# EAGLE design main (EAGLE 9.4.0)
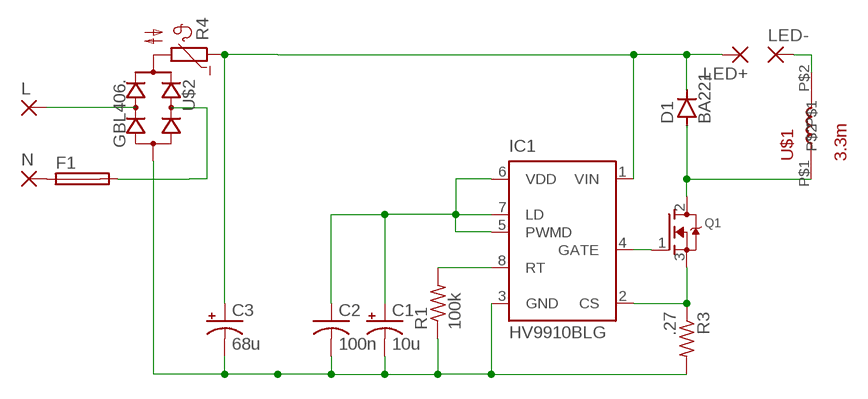
[diagram p0: schematic, sheet 1]

## Parts
C1  10u  CPOL-USCT7343  [CT7343]
C2  100n  C-USC0603  [C0603]
C3  68u  CPOL-USE7.5-16  [E7,5-16]
D1  BA221  [DO35-10]
F1  SH22,5A  [SH22,5A]
IC1  HV9910BLG  [SOIC-08LG]
L  2,54/1,0  [2,54/1,0]
LED+  2,54/1,0  [2,54/1,0]
LED-  2,54/1,0  [2,54/1,0]
N  2,54/1,0  [2,54/1,0]
Q1  MOSFET-NGDS_TO220V  [TO220V]
R1  100k  R-US_R0805  [R0805]
R3  .27  R-US_0207/7  [0207/7]
R4  B57164  [B57164]
U$1  3.3m  3.3MH  [3.3MH]
U$2  GBL406.  [GBL406]

## Nets
CS: IC1.2(CS) Q1.3(S) R3.1
GATE: IC1.4(GATE) Q1.1(G)
GND: C1.- C2.2 C3.- IC1.3(GND) R1.1 R3.2 U$2.-
L: L.1(P) U$2.AC@2(AC)
N: F1.2 U$2.AC@1(AC)
N$1: D1.A Q1.2(D) U$1.P$1
N$2: R4.2 U$2.+
N$3: IC1.8(RT) R1.2
N$4: F1.1 N.1(P)
N$6: LED-.1(P) U$1.P$2
V+: C3.+ D1.C IC1.1(VIN) LED+.1(P) R4.1
VDD: C1.+ C2.1 IC1.5(PWMD) IC1.6(VDD) IC1.7(LD)

## Library data of the parts
C1 C3 = rcl:CPOL-US: POLARIZED CAPACITOR, American symbol; SPICEPREFIX: C
C2 = rcl:C-US: CAPACITOR, American symbol; SPICEPREFIX: C
D1 = diode:BA221: DIODE high speed (Philips)
F1 = fuse:SH22,5A: FUSE HOLDER grid 22,5mm, isolated cap OGN0031 8201, Schurter (Buerklin); MPN: 0031.7701.11; OC_FARNELL: unknown; OC_NEWARK: 04F1224
IC1 = supertex:HV9910B: Universal High Brightness LED Driver Source: www.supertex.com .. led_driver_ics_SG.pdf; MPN: MXHV9910B; OC_FARNELL: unknown; OC_NEWARK: 15R9731
L LED+ LED- N = 7_segment_lib:2,54/1,0: THROUGH-HOLE PAD
Q1 = adafruit:MOSFET-N: N-Channel Mosfet 2N7002E - 60V 260mA SOT23 [Digikey: 2N7002ET1GOSTR-ND] - REEL BSH103 - 30V 850mA SOT23 [Digikey: 568-5013-1-ND]
R1 R3 = rcl:R-US_: RESISTOR, American symbol; SPICEPREFIX: R
R4 = ptc-ntc:B57164: SIEMENS NTC; MPN: B57164K474K52; OC_FARNELL: 9753451; OC_NEWARK: 29M3118
U$1 = 7_segment_lib:3.3MH
U$2 = 7_segment_lib:GBL406

## Board
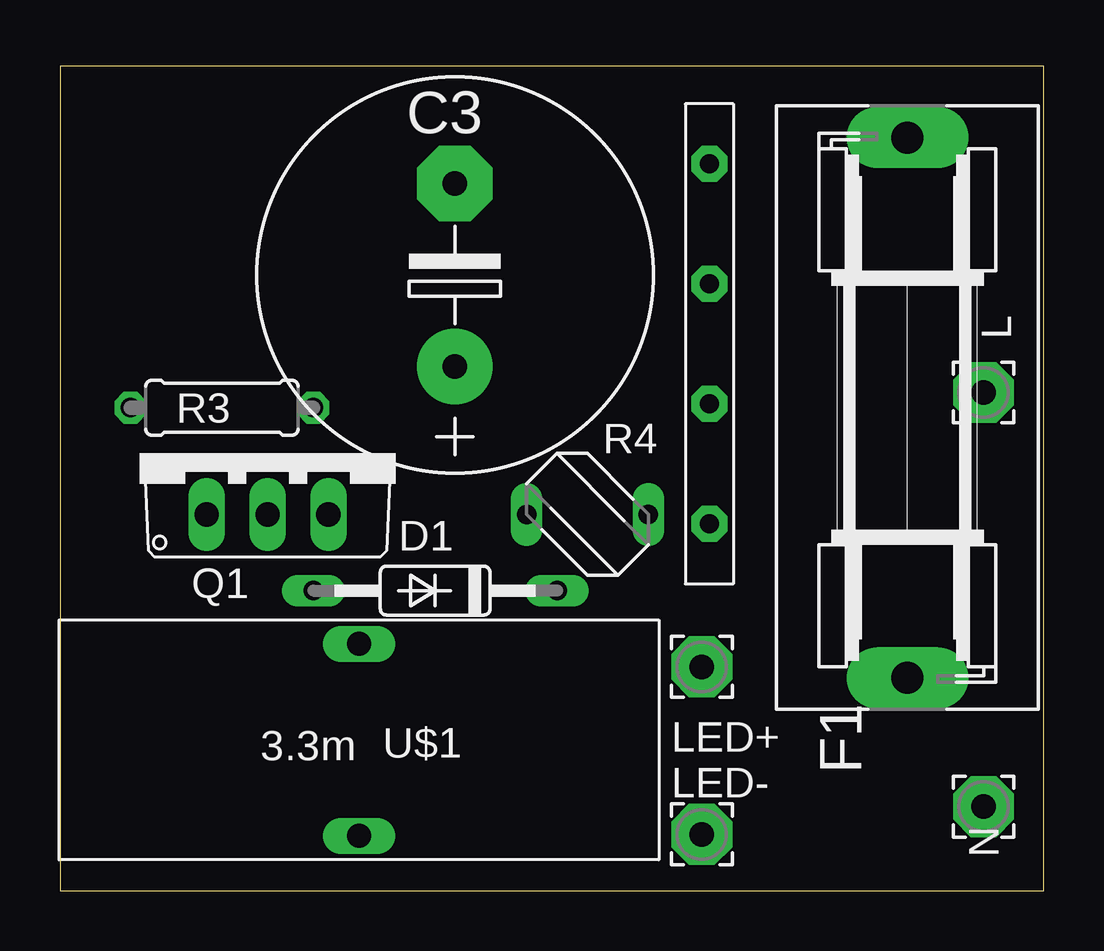
[diagram p1: board, top side]
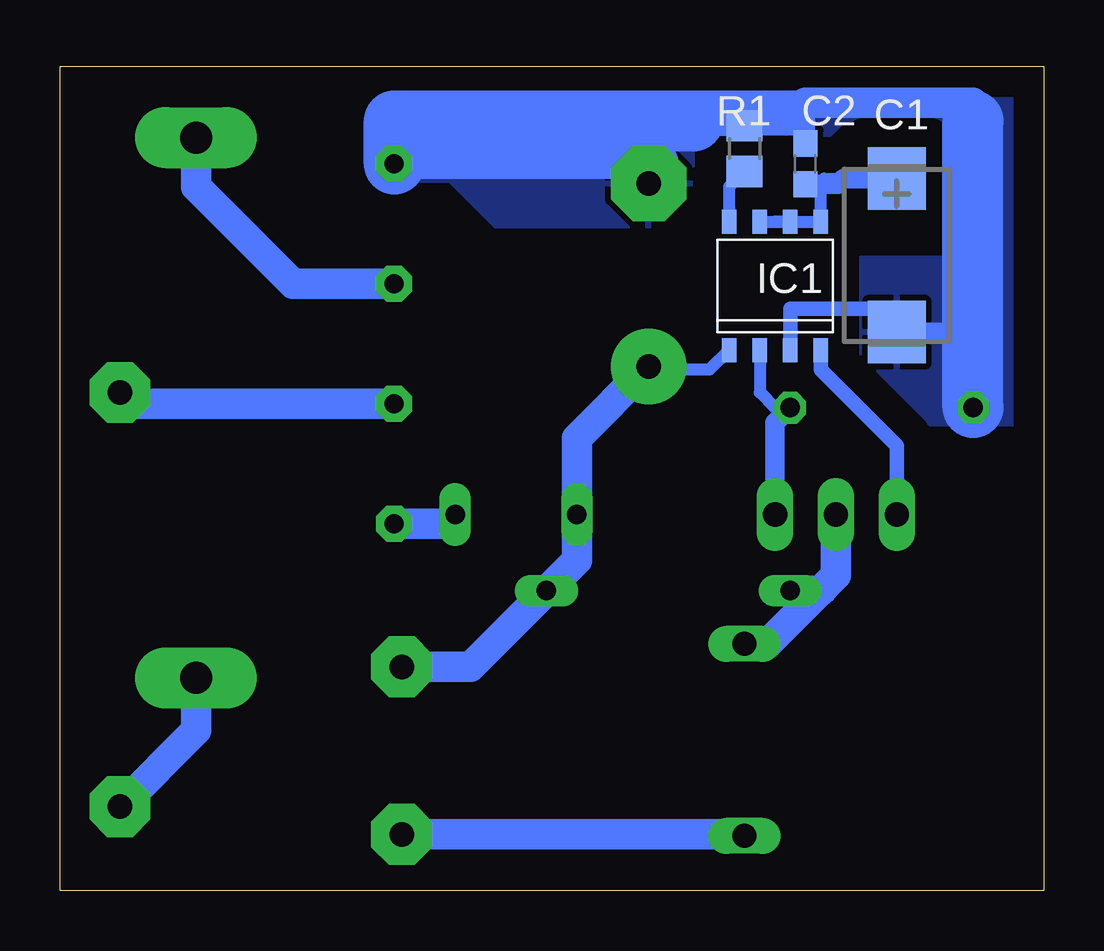
[diagram p2: board, bottom side, seen from below]

Size 41 x 34.37 mm. Coordinates in mm from the lower left corner, seen from the top.
Outline: 0,0 41,0 41,34.37 0,34.37 0,0
Copper layers (1*16): Top 0.035mm / dielectric 1.5mm / Bottom 0.035mm
Design rules "default": minimum track width 6mil, minimum drill 0.35mm, track to track 6mil, track to pad 6mil, pad to pad 6mil, via to via 6mil, smd to smd 6mil, copper to edge 40mil, drill to drill 6mil, minimum pad ring 10mil, minimum via ring 8mil, stop-mask expansion 4mil, vias tented up to drill 0mil, thermal gap 10mil

### Footprints (pad centres in the part's own frame; a part is rotated, then mirrored left to right if it is on the bottom)
CT7343 = smd 2.6 x 2.4: + -3.2,0; - 3.2,0
C0603 = smd 1.1 x 1: 1 -0.85,0; 2 0.85,0
E7,5-16 = drill 1.016 pad 3.15: + -3.81,0 | drill 1.016 pad 3.15 octagon: - 3.81,0
DO35-10 = drill 0.813 long: A 5.08,0; C -5.08,0
SH22,5A = drill 1.321 pad 2.54 long: 1 -11.252,0; 2 11.252,0
SOIC-08LG = smd 0.6 x 1: 1 -1.905,-2.675; 2 -0.635,-2.675; 3 0.635,-2.675; 4 1.905,-2.675; 5 1.905,2.675; 6 0.635,2.675; 7 -0.635,2.675; 8 -1.905,2.675
2,54/1,0 = drill 1.016 pad 2.54 octagon: 1 0,0
TO220V = drill 1.016 long: 1 -2.54,-2.54; 2 0,-2.54; 3 2.54,-2.54
R0805 = smd 1.3 x 1.5: 1 -0.95,0; 2 0.95,0
0207/7 = drill 0.813 octagon: 1 -3.81,0; 2 3.81,0
B57164 = drill 0.813 long: 1 -2.54,0; 2 2.54,0
3.3MH = drill 1 long: P$1 0,0; P$2 8,0
GBL406 = drill 0.8 pad 1.5 octagon: + 15,0; - 0,0; AC@1 5,0; AC@2 10,0

### Placement (x,y rotation side)
C1  6.12,26.48 270 bottom
C2  9.93,30.29 90 bottom
C3  16.46,25.66 90 top
D1  15.64,12.51 180 top
F1  35.33,20.13 90 top
IC1  11.2,25.21 0 bottom
L  38.5,20.76 0 top
LED+  26.75,9.34 0 top
LED-  26.75,2.35 0 top
N  38.5,3.51 0 top
Q1  8.65,18.22 0 top
R1  12.46,30.92 270 bottom
R3  6.75,20.13 180 top
R4  21.99,15.69 0 top
U$1  12.46,10.29 270 top
U$2  27.07,30.29 270 top

### Tracks (layer width: path | path; a pad name or v marks a point on that pad's centre or on a via)
CS
  Bottom 0.508: IC1.2 11.83,20.76 11.2,20.13 R3.1
  Bottom 0.813: R3.1 11.2,19.49 Q1.3
GATE
  Bottom 0.61: Q1.1 6.12,18.54 9.29,21.72 IC1.4
GND
  Bottom 0.61: IC1.3 10.56,24.26 6.75,24.26 6.12,23.62 C1.-
  Bottom 0.813: R1.1 9.93,31.88 | 9.93,31.88 C2.2 | 5.33,22.49 C1.- 3.23,23.28 2.94,22.99 | R3.2 2.94,22.99 | 2.94,22.99 2.94,23.62 | 9.93,31.88 9.93,32.71 9.93,32.83 2.94,32.83 2.94,32.08 2.94,22.99
  Bottom 1.27: U$2.- 16.54,30.29 16.46,30.21 | 14.61,32.08 13.34,32.08 13.97,32.08 14.61,32.71 9.93,32.71 | 2.94,32.83 9.93,32.83
  Bottom 2.54: R3.2 2.94,32.08 | C3.- 16.46,30.21 16.54,30.29 | U$2.- 27.07,32.08 14.61,32.08
  pour Bottom (isolate 1.27): 0.64,19.41 5.08,19.41 7.62,21.95 7.62,23.22 7.62,26.4 3.81,26.4 3.81,31.48 4.45,32.12 8.26,32.12 8.89,31.48 13.34,31.48 13.97,31.48 14.61,30.84 14.61,28.94 15.88,27.67 18.41,27.67 22.86,27.67 24.77,29.57 27.3,29.57 27.94,30.21 27.94,32.75 27.3,33.39 26.04,34.66 -0.64,34.66 -0.64,19.41
L
  Bottom 1.27: L.1 38.02,20.29 U$2.AC@2
N
  Bottom 0.813: F1.2 35.33,29.34 | 31.28,25.29 31.43,25.45
  Bottom 1.27: U$2.AC@1 31.28,25.29 | 31.43,25.45 35.33,29.34 F1.2
N$1
  Bottom 0.813: U$1.P$1 11.51,10.29 9.93,11.88 | 9.93,11.88 9.13,12.67 8.65,13.14 | D1.A 9.93,11.88
  Bottom 1.27: U$1.P$1 11.51,10.29 9.13,12.67 | 9.13,12.67 8.65,13.14 Q1.2 | D1.A 9.29,12.51 9.13,12.67
N$2
  Bottom 1.27: U$2.+ 24.93,15.29 R4.2
N$3
  Bottom 0.508: R1.2 13.1,29.34 IC1.8
N$4
  Bottom 1.27: N.1 35.33,6.69 F1.1
N$6
  Bottom 1.27: U$1.P$2 12.53,2.35 LED-.1
V+
  Bottom 0.508: IC1.1 13.92,21.72 16.33,21.72 C3.+
  Bottom 1.27: LED+.1 23.89,9.34 D1.C 19.45,13.78 R4.1 19.45,18.86 C3.+
VDD
  Bottom 0.508: IC1.7 11.2,27.88 | 11.2,27.88 IC1.5 9.29,29.34 9.39,29.44 | IC1.6 11.2,27.88 | 9.39,29.44 C2.1 | 6.75,29.68 C1.+ | 8.34,29.68 9.15,29.68 9.39,29.44
  Bottom 0.813: 6.75,29.68 8.34,29.68 8.58,29.44 C2.1